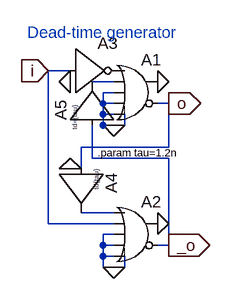
[diagram p0: schematic dead-time-gen-fast.asc]
dead-time-gen-fast.asc, the LTspice schematic file:
Version 4
SHEET 1 880 680
WIRE 112 16 80 16
WIRE 176 32 144 32
WIRE 176 48 160 48
WIRE 160 64 160 48
WIRE 176 64 160 64
WIRE 256 64 240 64
WIRE 160 80 160 64
WIRE 176 80 160 80
WIRE 160 96 160 80
WIRE 176 96 160 96
WIRE 192 96 192 80
WIRE 192 96 176 96
WIRE 256 128 256 64
WIRE 256 128 128 128
WIRE 144 144 144 96
WIRE 256 144 144 144
WIRE 128 160 128 128
WIRE 176 224 128 224
WIRE 80 240 80 16
WIRE 176 240 80 240
WIRE 176 256 160 256
WIRE 160 272 160 256
WIRE 176 272 160 272
WIRE 256 272 256 144
WIRE 256 272 240 272
WIRE 160 288 160 272
WIRE 176 288 160 288
WIRE 160 304 160 288
WIRE 176 304 160 304
WIRE 192 304 192 288
WIRE 192 304 176 304
FLAG 176 96 0
FLAG 176 304 0
FLAG 112 32 0
FLAG 256 64 o
IOPIN 256 64 Out
FLAG 256 272 _o
IOPIN 256 272 Out
FLAG 80 16 i
IOPIN 80 16 In
FLAG 112 160 0
FLAG 240 240 0
FLAG 240 32 0
SYMBOL Digital\\or 208 -16 R0
SYMATTR InstName A1
SYMBOL Digital\\inv 112 -48 R0
SYMATTR InstName A3
SYMBOL Digital\\or 208 192 R0
SYMATTR InstName A2
SYMBOL Digital\\buf1 192 160 R90
WINDOW 0 7 20 Left 2
WINDOW 3 1 41 Left 0
SYMATTR InstName A4
SYMATTR Value td{tau}
SYMBOL Digital\\buf1 80 96 R270
WINDOW 0 7 18 Left 2
WINDOW 3 -7 39 Left 0
SYMATTR InstName A5
SYMATTR Value td={tau}
TEXT 272 -40 Right 2 ;Dead-time generator
TEXT 152 136 Left 1 !.param tau=1.2n

The netlist it stands for:
* dead-time-gen-fast.asc
A1 P001 N001 0 0 0 o 0 0 OR
A3 i 0 0 0 0 P001 0 0 BUF
A2 N002 i 0 0 0 _o 0 0 OR
A4 o 0 0 0 0 0 N002 0 BUF td{tau}
A5 _o 0 0 0 0 0 N001 0 BUF td={tau}
* Dead-time generator
.param tau=1.2n
.backanno
.end